# Altium schematic sheet Controller.SchDoc
size A3
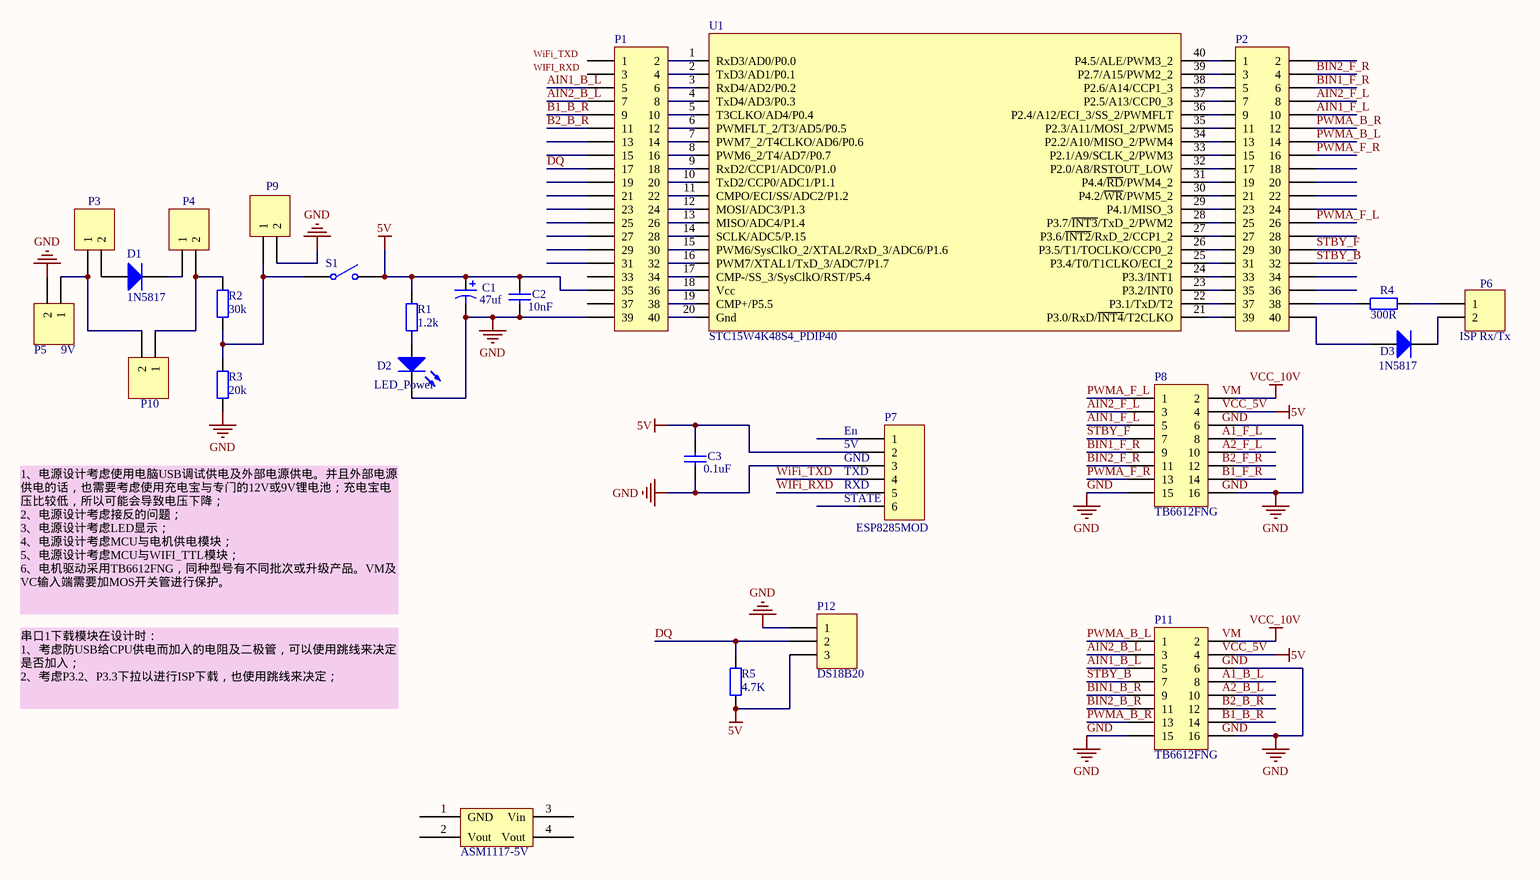
[diagram p0: Controller.SchDoc]

## Parts
ASM1117-5V  ASM1117-5V  [SOT-223]  (value not drawn)
C1  value 47uf  [RB7.6-15]  (hidden comment: Cap Pol1)
C2  value 10nF  [RAD-0.3]  (hidden comment: Cap)
C3  value 0.1uF  [RAD-0.3]  (hidden comment: Cap)
D1  1N5817  [DO-35]
D2  LED_Power  [LED-0]
D3  1N5817  [DO-35]
P1  Header 20X2  [HDR2X20]  (value not drawn)
P2  Header 20X2  [HDR2X20]  (value not drawn)
P3  Header 2  [HDR1X2]  (value not drawn)
P4  Header 2  [HDR1X2]  (value not drawn)
P5  9V  [HDR1X2]
P6  ISP Rx/Tx  [HDR1X2]
P7  ESP8285MOD  [HDR1X6]
P8  TB6612FNG  [HDR2X8]
P9  Header 2  [HDR1X2]  (value not drawn)
P10  Header 2  [HDR1X2]  (value not drawn)
P11  TB6612FNG  [HDR2X8]
P12  DS18B20  [HDR1X3]
R1  value 1.2k  [AXIAL-0.4]  (hidden comment: Res2)
R2  value 30k  [AXIAL-0.4]  (hidden comment: Res2)
R3  value 20k  [AXIAL-0.4]  (hidden comment: Res2)
R4  value 300R  [AXIAL-0.4]  (hidden comment: Res2)
R5  value 4.7K  [AXIAL-0.4]  (hidden comment: Res2)
S1  SW-SPST  [SPST-2]  (value not drawn)
U1  STC15W4K48S4_PDIP40  [STC15W4K48S4_DIP40]

## Nets
5V: C1.1 C2.2 C3.2 P1.35 P7.2 P8.4 P11.4 P12.3 R1.1 R5.2 S1.2(NO)
GND: C1.2 C2.1 C3.1 D2.2(K) P1.39 P5.2 P7.3 P8.6 P8.15 P8.16 P9.2 P11.6 P11.15 P11.16 P12.1 R3.1
VCC_10V: P8.2 P11.2
AIN1_B_L: P1.5 P11.5
AIN1_F_L: P2.10 P8.5
AIN2_B_L: P1.7 P11.3
AIN2_F_L: P2.8 P8.3
B1_B_R: P1.9
B2_B_R: P1.11
BIN1_B_R: P11.9
BIN1_F_R: P2.6 P8.9
BIN2_B_R: P11.11
BIN2_F_R: P2.4 P8.11
DQ: P1.17 P12.2 R5.1
PWMA_B_L: P2.14 P11.1
PWMA_B_R: P2.12 P11.13
PWMA_F_L: P2.26 P8.1
PWMA_F_R: P2.16 P8.13
STBY_B: P2.32 P11.7
STBY_F: P2.30 P8.7
WIFi_RXD: P7.5
WiFi_TXD: P7.4
NetD1_1: D1.1(A) P3.2
NetD1_2: D1.2(K) P4.1
NetD2_1: D2.1(A) R1.2
NetD3_1: D3.1(A) P2.40
NetD3_2: D3.2(K) P6.2
NetP1_2: P1.2 U1.1(RxD3/AD0/P0.0)
NetP1_4: P1.4 U1.2(TxD3/AD1/P0.1)
NetP1_6: P1.6 U1.3(RxD4/AD2/P0.2)
NetP1_8: P1.8 U1.4(TxD4/AD3/P0.3)
NetP1_10: P1.10 U1.5(T3CLKO/AD4/P0.4)
NetP1_12: P1.12 U1.6(PWMFLT_2/T3/AD5/P0.5)
NetP1_14: P1.14 U1.7(PWM7_2/T4CLKO/AD6/P0.6)
NetP1_16: P1.16 U1.8(PWM6_2/T4/AD7/P0.7)
NetP1_18: P1.18 U1.9(RxD2/CCP1/ADC0/P1.0)
NetP1_20: P1.20 U1.10(TxD2/CCP0/ADC1/P1.1)
NetP1_22: P1.22 U1.11(CMPO/ECI/SS/ADC2/P1.2)
NetP1_24: P1.24 U1.12(MOSI/ADC3/P1.3)
NetP1_26: P1.26 U1.13(MISO/ADC4/P1.4)
NetP1_28: P1.28 U1.14(SCLK/ADC5/P.15)
NetP1_30: P1.30 U1.15(PWM6/SysClkO_2/XTAL2/RxD_3/ADC6/P1.6)
NetP1_32: P1.32 U1.16(PWM7/XTAL1/TxD_3/ADC7/P1.7)
NetP1_34: P1.34 U1.17(CMP-/SS_3/SysClkO/RST/P5.4)
NetP1_36: P1.36 U1.18(Vcc)
NetP1_38: P1.38 U1.19(CMP+/P5.5)
NetP1_40: P1.40 U1.20(Gnd)
NetP2_1: P2.1 U1.40(P4.5/ALE/PWM3_2)
NetP2_3: P2.3 U1.39(P2.7/A15/PWM2_2)
NetP2_5: P2.5 U1.38(P2.6/A14/CCP1_3)
NetP2_7: P2.7 U1.37(P2.5/A13/CCP0_3)
NetP2_9: P2.9 U1.36(P2.4/A12/ECI_3/SS_2/PWMFLT)
NetP2_11: P2.11 U1.35(P2.3/A11/MOSI_2/PWM5)
NetP2_13: P2.13 U1.34(P2.2/A10/MISO_2/PWM4)
NetP2_15: P2.15 U1.33(P2.1/A9/SCLK_2/PWM3)
NetP2_17: P2.17 U1.32(P2.0/A8/RSTOUT_LOW)
NetP2_19: P2.19 U1.31(P4.4/~{RD}/PWM4_2)
NetP2_21: P2.21 U1.30(P4.2/~{WR}/PWM5_2)
NetP2_23: P2.23 U1.29(P4.1/MISO_3)
NetP2_25: P2.25 U1.28(P3.7/~{INT3}/TxD_2/PWM2)
NetP2_27: P2.27 U1.27(P3.6/~{INT2}/RxD_2/CCP1_2)
NetP2_29: P2.29 U1.26(P3.5/T1/TOCLKO/CCP0_2)
NetP2_31: P2.31 U1.25(P3.4/T0/T1CLKO/ECI_2)
NetP2_33: P2.33 U1.24(P3.3/INT1)
NetP2_35: P2.35 U1.23(P3.2/INT0)
NetP2_37: P2.37 U1.22(P3.1/TxD/T2)
NetP2_38: P2.38 R4.1
NetP2_39: P2.39 U1.21(P3.0/RxD/~{INT4}/T2CLKO)
NetP3_1: P3.1 P5.1 P10.2
NetP4_2: P4.2 P10.1 R2.2
NetP6_1: P6.1 R4.2
NetP9_1: P9.1 R2.1 R3.2 S1.1(COMMON)

Not connected (* = marked no-connect by the designer): ASM1117-5V 1(GND) 2(Vout) 3(Vin) 4(Vout); P1 1 3 13 15 19 21 23 25 27 29 31 33 37; P2 2 18 20 22 24 28 34 36; P7 1 6; P8 8 10 12 14; P11 8 10 12 14

## Notes on the sheet
- (near P7) En
- (near P7) 5V
- (near P7) GND
- (near P7) TXD
- (near P7) RXD
- (near P7) STATE
- 1、电源设计考虑使用电脑USB调试供电及外部电源供电。并且外部电源供电的话，也需要考虑使用充电宝与专门的12V或9V锂电池；充电宝电压比较低，所以可能会导致电压下降；
  2、电源设计考虑接反的问题；
  3、电源设计考虑LED显示；
  4、电源设计考虑MCU与电机供电模块；
  5、电源设计考虑MCU与WIFI_TTL模块；
  6、电机驱动采用TB6612FNG，同种型号有不同批次或升级产品。VM及VC输入端需要加MOS开关管进行保护。
- 串口1下载模块在设计时：
  1、考虑防USB给CPU供电而加入的电阻及二极管，可以使用跳线来决定是否加入；
  2、考虑P3.2、P3.3下拉以进行ISP下载，也使用跳线来决定；
- Labels drawn without touching a wire or pin: A1_B_L, A1_F_L, A2_B_L, A2_F_L, B1_B_R, B1_F_R, B2_B_R, B2_F_R, GND, VCC_5V, VM, WIFI_RXD, WiFi_TXD

## Library data of the parts
C1 = Cap Pol1: Polarized Capacitor (Radial); Published: 8-Jun-2000; LatestRevisionDate: 17-Jul-2002; LatestRevisionNote: Re-released for DXP Platform.; PackageReference: RB7.6-15; Publisher: Altium Limited; PackageDescription: Polarized Capacitor (Radial); 2 Leads
C2 C3 = Cap: Capacitor; Published: 8-Jun-2000; LatestRevisionDate: 17-Jul-2002; LatestRevisionNote: Re-released for DXP Platform.; PackageReference: RAD-0.3; Publisher: Altium Limited; PackageDescription: Radial Cap, Thru-Hole; 2 Leads; 0.3 in Pin Spacing
D1 D3 = Diode 1N914: High Conductance Fast Diode; Published: 8-Jun-2000; LatestRevisionDate: 17-Jul-2002; LatestRevisionNote: Re-released for DXP Platform.; DatasheetVersion: 1997; PackageReference: DO-35; Publisher: Altium Limited; PackageDescription: Diode, Axial; Body 3.8 x 1.9 mm (LxDia. max), Lead Dia. 0.53 mm (max); Code_JEDEC: DO-204-AH; ComponentLink1Description: Manufacturer Link; ComponentLink1URL: http://www.fairchildsemi.com/; ComponentLink2Description: Datasheet; ComponentLink2URL: http://www.fairchildsemi.com/ds/1N%2F1N4448.pdf
D2 = LED0: Typical INFRARED GaAs LED; Published: 8-Jun-2000; LatestRevisionDate: 08-Jul-2005; LatestRevisionNote: Mech Layer 1 removed.; PackageReference: LED-0; Publisher: Altium Limited; PackageDescription: LED; 2 Leads
P1 P2 = Header 20X2: Header, 20-Pin, Dual row; LatestRevisionDate: 17-Jul-2002; LatestRevisionNote: Re-released for DXP Platform.; Publisher: Altium Limited
P3-P6 P9 P10 = Header 2: Header, 2-Pin; LatestRevisionDate: 17-Jul-2002; LatestRevisionNote: Re-released for DXP Platform.; Publisher: Altium Limited
P7 = Header 6: Header, 6-Pin; LatestRevisionDate: 17-Jul-2002; LatestRevisionNote: Re-released for DXP Platform.; Publisher: Altium Limited
P8 P11 = Header 8X2: Header, 8-Pin, Dual row; LatestRevisionDate: 17-Jul-2002; LatestRevisionNote: Re-released for DXP Platform.; Publisher: Altium Limited
P12 = Header 3: Header, 3-Pin; LatestRevisionDate: 17-Jul-2002; LatestRevisionNote: Re-released for DXP Platform.; Publisher: Altium Limited
R1-R5 = Res2: Resistor; Published: 8-Jun-2000; LatestRevisionDate: 17-Jul-2002; LatestRevisionNote: Re-released for DXP Platform.; PackageReference: AXIAL-0.4; Publisher: Altium Limited; PackageDescription: Axial Device, Thru-Hole; 2 Leads; 0.4 in Pin Spacing
S1 = SW-SPST: Single-Pole, Single-Throw Switch; Published: 24-Mar-1999; LatestRevisionDate: 17-Jul-2002; LatestRevisionNote: Re-released for DXP Platform.; PackageReference: SPST-2; Publisher: Altium Limited; PackageDescription: Switch; 2 Leads
U1 = STC15W4K48S4_PDIP40: STC15W4K48S4